# EAGLE schematic Accumulator TS Schematic (EAGLE 9.6.2)
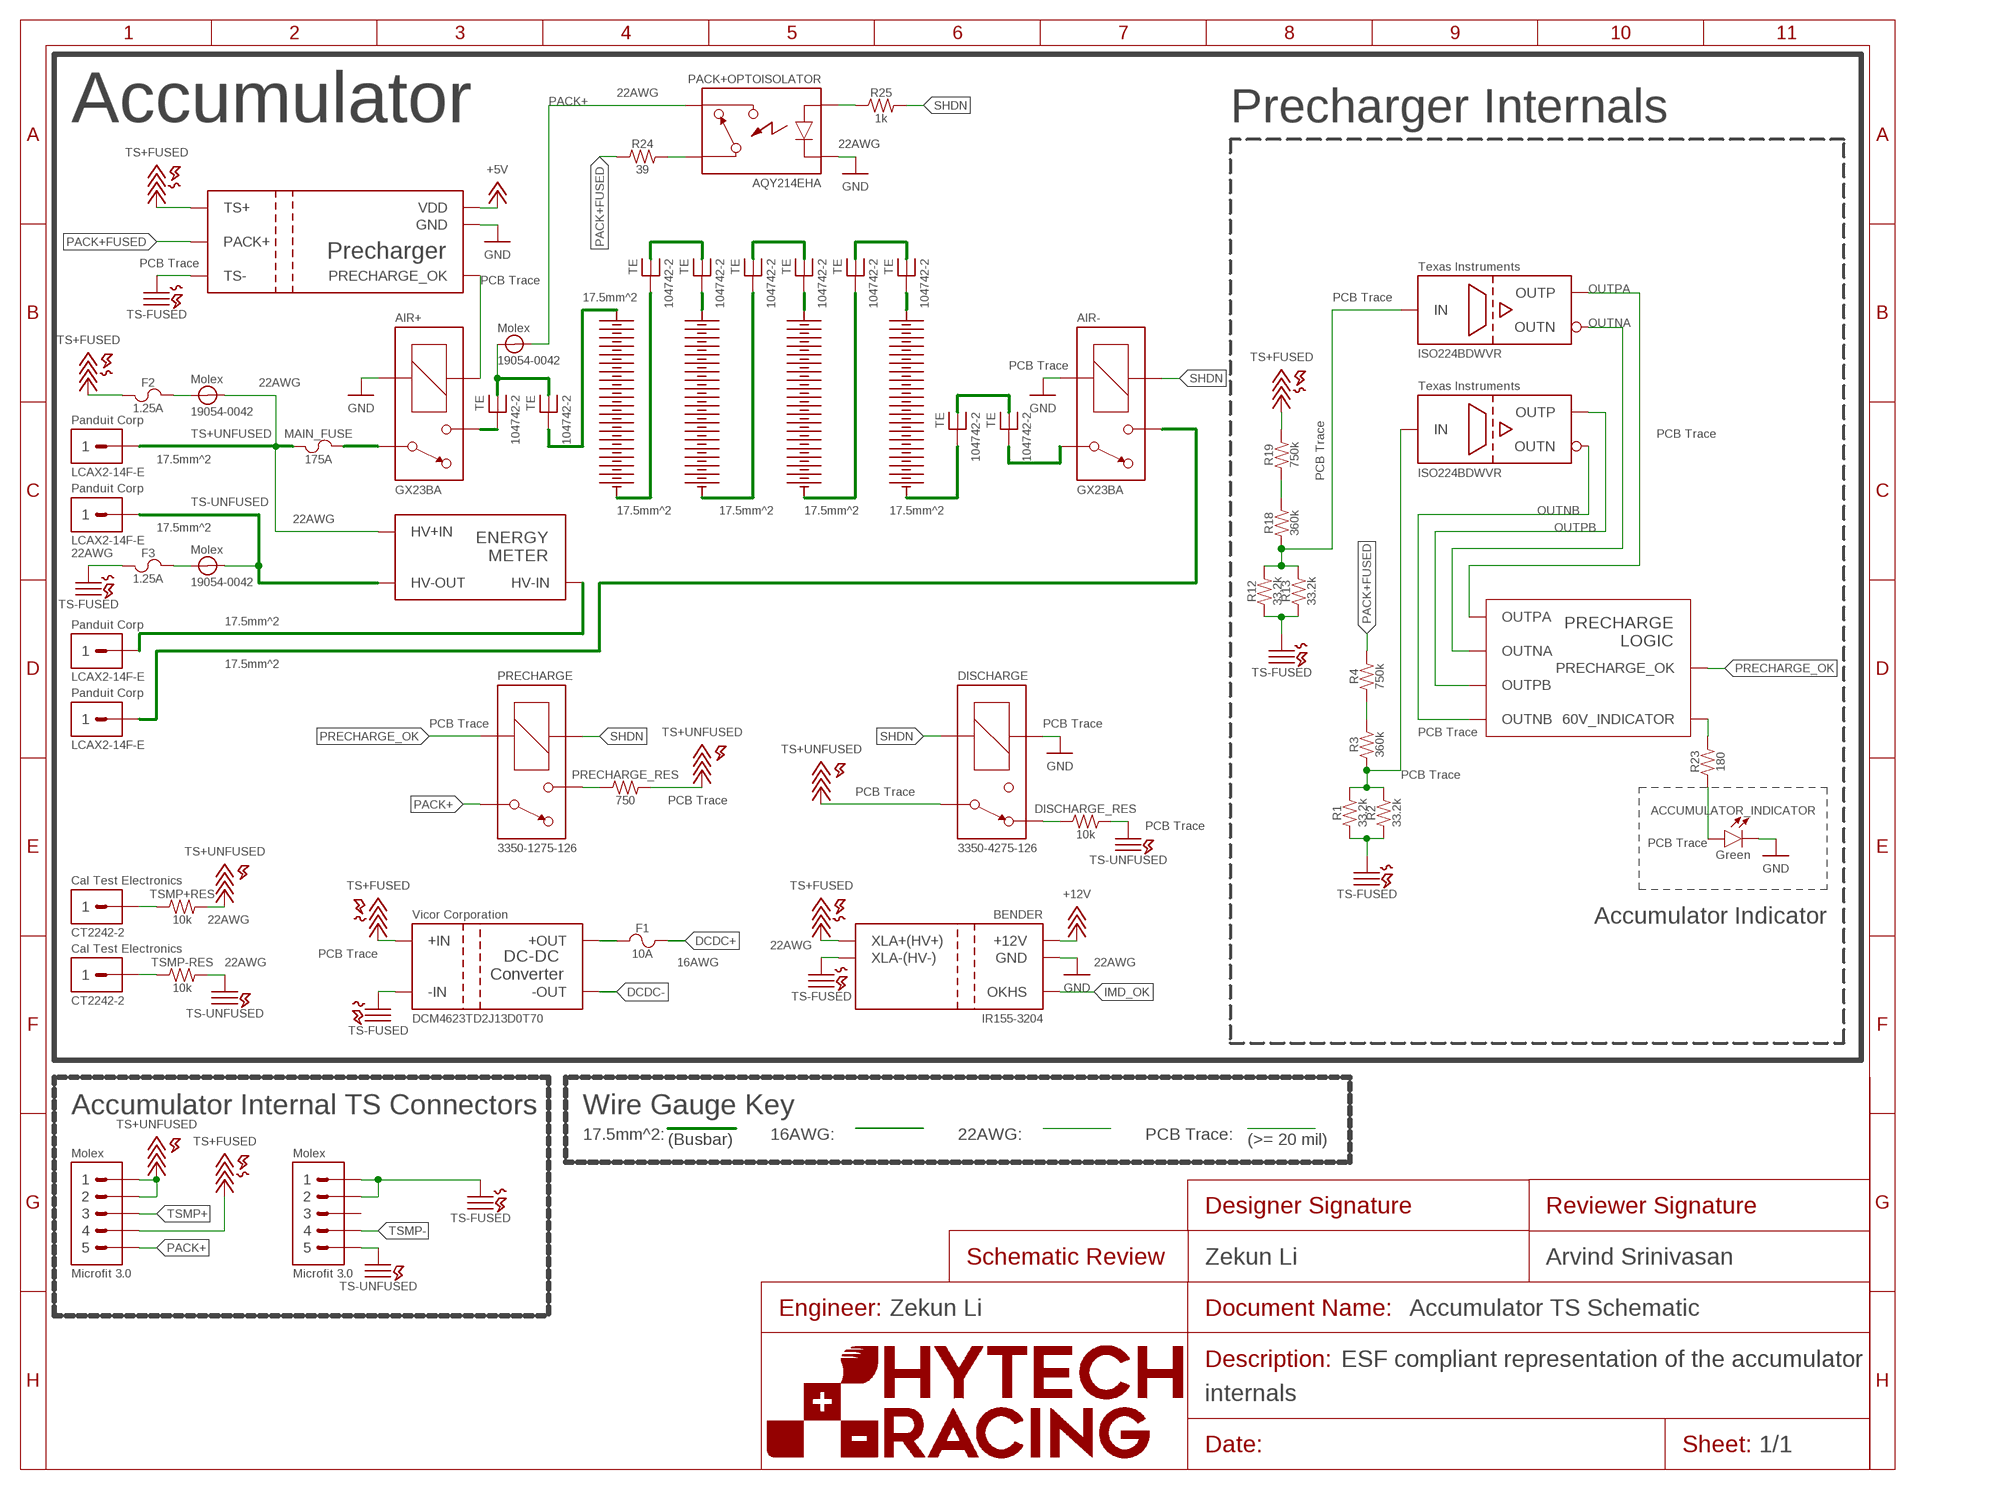
[diagram p0: schematic, sheet 1]
U$10 (FRAME_SCHEMATIC_ONLY): DESCRIPTION_1: ESF compliant representation of the accumulator; DESCRIPTION_2: internals; DESIGNER_SCHEMATIC: Zekun Li; ENGINEER: Zekun Li; REVIEWER_SCHEMATIC: Arvind Srinivasan

## Parts
ACCUMULATOR_INDICATOR  DIODE_LED  (no package)
AIR+  RELAY_SPST_NO_GX23BA  (no package)
AIR-  RELAY_SPST_NO_GX23BA  (no package)
DISCHARGE  RELAY_SPST_NC_3350-4275-126  (no package)
DISCHARGE_RES  10k  RESISTOR  (no package)
F1  10A  FUSE  (no package)
F2  1.25A  FUSE  (no package)
F3  1.25A  FUSE  (no package)
J1  CONNECTOR-1_LCAX2-14F-E  (no package)
J2  CONNECTOR-1_LCAX2-14F-E  (no package)
J3  CONNECTOR-1_LCAX2-14F-E  (no package)
J4  CONNECTOR-1_LCAX2-14F-E  (no package)
J5  CONNECTOR-1_CT2242-2  (no package)
J6  CONNECTOR-5_MICROFIT  (no package)
J7  CONNECTOR-1_CT2242-2  (no package)
J8  CONNECTOR-5_MICROFIT  (no package)
MAIN_FUSE  175A  FUSE  (no package)
PACK+OPTOISOLATOR  RELAY_SOLIDSTATE_NO_AQY214EHA  (no package)
PRECHARGE  RELAY_SPST_NO_3350-1275-126  (no package)
PRECHARGE_RES  750  RESISTOR  (no package)
R1  33.2k  RESISTOR  (no package)
R2  33.2k  RESISTOR  (no package)
R3  360k  RESISTOR  (no package)
R4  750k  RESISTOR  (no package)
R12  33.2k  RESISTOR  (no package)
R13  33.2k  RESISTOR  (no package)
R18  360k  RESISTOR  (no package)
R19  750k  RESISTOR  (no package)
R23  180  RESISTOR  (no package)
R24  39  RESISTOR  (no package)
R25  1k  RESISTOR  (no package)
TSMP+RES  10k  RESISTOR  (no package)
TSMP-RES  10k  RESISTOR  (no package)
U1  ISO_224BDWVR  (no package)
U2  ISO_224BDWVR  (no package)
U$1  BENDER_IR155-3204  (no package)
U$2  DC-DC_CONVERTER_DCM4623TD2J13D0T70  (no package)
U$3  SEGMENT  (no package)
U$4  SEGMENT  (no package)
U$5  SEGMENT  (no package)
U$6  SEGMENT  (no package)
U$7  MAINTENANCE_PLUG_104742-2  (no package)
U$8  MAINTENANCE_PLUG_104742-2  (no package)
U$9  MAINTENANCE_PLUG_104742-2  (no package)
U$11  PRECHARGER  (no package)
U$14  ENERGY_METER  (no package)
U$15  MAINTENANCE_PLUG_104742-2  (no package)
U$16  MAINTENANCE_PLUG_104742-2  (no package)
U$30  PRECHARGE_LOGIC  (no package)
U$31  MAINTENANCE_PLUG_104742-2  (no package)
U$32  MAINTENANCE_PLUG_104742-2  (no package)
U$33  MAINTENANCE_PLUG_104742-2  (no package)
U$34  MAINTENANCE_PLUG_104742-2  (no package)
U$35  MAINTENANCE_PLUG_104742-2  (no package)
U$36  RING_TERMINAL_19054-0042  (no package)
U$37  RING_TERMINAL_19054-0042  (no package)
U$38  RING_TERMINAL_19054-0042  (no package)

## Nets
+5V: U$11.VDD
+12V: U$1.+12V
DCDC+: F1.1
DCDC-: U$2.-OUT
GND: ACCUMULATOR_INDICATOR.C AIR+.COIL+ AIR-.COIL+ DISCHARGE.COIL- PACK+OPTOISOLATOR.CONTROL- U$1.GND U$11.GND
IMD_OK: U$1.OKHS
N$1: U$3.- U$7.1
N$2: U$4.- U$15.1
N$3: U$5.- U$16.1
N$4: U$4.+ U$8.1
N$5: U$5.+ U$9.1
N$6: U$6.+ U$31.1
N$7: U$7.P$1 U$8.P$1
N$8: PRECHARGE.CONTACT2 PRECHARGE_RES.1
N$10: PACK+OPTOISOLATOR.CONTACT1 R24.2
N$11: PACK+OPTOISOLATOR.CONTROL+ R25.1
N$12: DISCHARGE.CONTACT2 DISCHARGE_RES.1
N$13: R3.2 R4.1
N$14: R18.2 R19.1
N$15: AIR-.CONTACT1 U$35.1
N$16: U$6.- U$34.1
N$17: AIR+.CONTACT2 U$32.1
N$18: F1.2 U$2.+OUT
N$21: U$9.P$1 U$15.P$1
N$23: U$16.P$1 U$31.P$1
N$29: R1.2 R2.2 R3.1 U1.IN
N$30: U$32.P$1 U$33.P$1 U$38.P$1
N$33: U$34.P$1 U$35.P$1
N$43: R23.2 U$30.60V_INDICATOR
N$44: ACCUMULATOR_INDICATOR.A R23.1
N$45: J3.1 U$14.HV-IN
N$47: AIR-.CONTACT2 J4.1
N$48: R12.2 R13.2 R18.1 U2.IN
N$50: F3.2 U$36.P$1
N$51: F2.2 U$37.P$1
OUTNA: U2.OUTN U$30.OUTNA
OUTNB: U1.OUTN U$30.OUTNB
OUTPA: U2.OUTP U$30.OUTPA
OUTPB: U1.OUTP U$30.OUTPB
PACK+: J6.5 PACK+OPTOISOLATOR.CONTACT2 PRECHARGE.CONTACT1 U$3.+ U$33.1 U$38.P$2
PACK+FUSED: R4.2 R24.1 U$11.PACK+
PRECHARGE_OK: AIR+.COIL- PRECHARGE.COIL+ U$11.PRECHARGE_OK U$30.PRECHARGE_OK
SHDN: AIR-.COIL- DISCHARGE.COIL+ PRECHARGE.COIL- R25.2
TS+: F2.1 J6.4 R19.2 U$1.XLA+(HV+) U$2.+IN U$11.TS+ ; supply symbol labelled TS+FUSED
TS+UNFUSED: AIR+.CONTACT1 DISCHARGE.CONTACT1 J2.1 J6.1 J6.2 MAIN_FUSE.1 MAIN_FUSE.2 PRECHARGE_RES.2 TSMP+RES.2 U$14.HV+IN U$37.P$2
TS-UNFUSED: DISCHARGE_RES.2 F3.1 J1.1 J8.1 J8.2 J8.5 R1.1 R2.1 R12.1 R13.1 TSMP-RES.2 U$1.XLA-(HV-) U$2.-IN U$11.TS- U$14.HV-OUT U$36.P$2 ; supply symbol labelled TS-FUSED
TSMP+: J5.1 J6.3 TSMP+RES.1
TSMP-: J7.1 J8.4 TSMP-RES.1
Unconnected: J8.3

## Notes on the sheet
- Accumulator
- 22AWG
- Precharger Internals
- 22AWG
- PCB Trace
- PCB Trace
- 17.5mm^2 | PCB Trace
- PCB Trace
- 22AWG
- PCB Trace
- 17.5mm^2
- PCB Trace
- 22AWG | 17.5mm^2 | 17.5mm^2 | 17.5mm^2 | 17.5mm^2
- 17.5mm^2
- 22AWG
- 17.5mm^2
- 17.5mm^2
- PCB Trace | PCB Trace
- PCB Trace
- PCB Trace
- PCB Trace
- PCB Trace
- PCB Trace
- PCB Trace
- Accumulator Indicator
- 22AWG
- 22AWG
- 22AWG | PCB Trace | 16AWG | 22AWG
- Accumulator Internal TS Connectors | Wire Gauge Key
- 17.5mm^2: | 16AWG: | 22AWG: | PCB Trace:
- (Busbar) | (>= 20 mil)

## Library data of the parts
ACCUMULATOR_INDICATOR = HyTechSymbolsTemp:DIODE_LED; COLOR: Green
AIR+ AIR- = HyTechSymbolsTemp:RELAY_SPST_NO_?*: Single pole single throw normally open relay 3350-1275-126 <https://drive.google.com/file/d/1L0NeZqCX2TFaVQbwFxpbbu9uMJSPuulv/view> GX23BA <https://drive.google.com/file/d/1Ccq0vir690jgHxUhztItQKfgtS51YNj_/view>; MANUFACTURER: Gigavac; MPN: GX23BA
DISCHARGE = HyTechSymbolsTemp:RELAY_SPST_NC_?*: Single pole single throw normally closed relay 3350-4275-126 <https://drive.google.com/file/d/1L0NeZqCX2TFaVQbwFxpbbu9uMJSPuulv/view>; MANUFACTURER: Comus; MPN: 3350-4275-126
DISCHARGE_RES PRECHARGE_RES R1-R4 R12 R13 R18 R19 R23-R25 TSMP+RES TSMP-RES = HyTechSymbolsTemp:RESISTOR
F1-F3 MAIN_FUSE = HyTechSymbolsTemp:FUSE
J1-J4 = HyTechSymbolsTemp:CONNECTOR-1_*: Single pin connector CT2242-2 <https://drive.google.com/file/d/1rFz1F44pFGMLks1TuzNftb-wQBk0xWUD/view> LCAX2-14F-E <https://drive.google.com/file/d/1bbvHAAOUtBwm4fAPUWES_iBsARNVuAgN/view>; MANUFACTURER: Panduit Corp; MPN: LCAX2-14F-E
J5 J7 = HyTechSymbolsTemp:CONNECTOR-1_*: Single pin connector CT2242-2 <https://drive.google.com/file/d/1rFz1F44pFGMLks1TuzNftb-wQBk0xWUD/view> LCAX2-14F-E <https://drive.google.com/file/d/1bbvHAAOUtBwm4fAPUWES_iBsARNVuAgN/view>; MANUFACTURER: Cal Test Electronics; MPN: CT2242-2
J6 J8 = HyTechSymbolsTemp:CONNECTOR-5_*: Five pin connector Micro-Fit 3.0 <https://drive.google.com/file/d/1Be8WGxzm3IeOWSN4qfSP8J4bwHUWCwaO/view>; MANUFACTURER: Molex; MPN: Microfit 3.0
PACK+OPTOISOLATOR = HyTechSymbolsTemp:RELAY_SOLIDSTATE_NO_*: Solid-state single pole single throw normally open relay CMX60D20 <https://drive.google.com/file/d/11HaAODTxMI5zJ0hT5nquYCFtw3_aAMfR/view>; MANUFACTURER: Panasonic Industrial Devices; MPN: AQY214EHA
PRECHARGE = HyTechSymbolsTemp:RELAY_SPST_NO_?*: Single pole single throw normally open relay 3350-1275-126 <https://drive.google.com/file/d/1L0NeZqCX2TFaVQbwFxpbbu9uMJSPuulv/view> GX23BA <https://drive.google.com/file/d/1Ccq0vir690jgHxUhztItQKfgtS51YNj_/view>; MANUFACTURER: Comus; MPN: 3350-1275-126
U1 U2 = HyTechSymbolsTemp:ISO_224*: ISO224*: Isolated precision amplifier Datasheet <https://www.ti.com/lit/ds/symlink/iso224.pdf>; MANUFACTURER: Texas Instruments; MPN: ISO224BDWVR
U$1 = HyTechSymbols:BENDER_IR155-3204: Bender IR155-3204 Insulation Monitoring Device Datasheet <http://www.bender-es.com/fileadmin/products/doc/IR155-32xx-V004_D00115_D_XXEN.pdf>
U$2 = HyTechSymbols:DC-DC_CONVERTER_*: DC_DC Converter Vicor DCM Series <https://www.mouser.com/datasheet/2/685/DCM4623xD2J13D0y7z_ds-1144763.pdf>; MANUFACTURER: Vicor Corporation; MPN: DCM4623TD2J13D0T70
U$3-U$6 = HyTechSymbols:SEGMENT
U$7-U$9 U$15 U$16 U$31-U$35 = HyTechSymbolsTemp:MAINTENANCE_PLUG_*; MANUFACTURER: TE; MPN: 104742-2
U$11 = HyTechSymbolsTemp:PRECHARGER: Block representation of the HT06 precharger.
U$14 = HyTechSymbolsTemp:ENERGY_METER: Block representation of the FSAE energy meter.
U$30 = HyTechSymbolsTemp:PRECHARGE_LOGIC: Block representation of the precharge logic.
U$36-U$38 = HyTechSymbolsTemp:RING_TERMINAL_*: Ring terminal 19054-0042 <https://drive.google.com/drive/folders/1JhKTbRtwaszOvYIb3y-YkBSe0CyrUopM>; MANUFACTURER: Molex; MPN: 19054-0042